# EAGLE schematic Board (EAGLE 6.4)
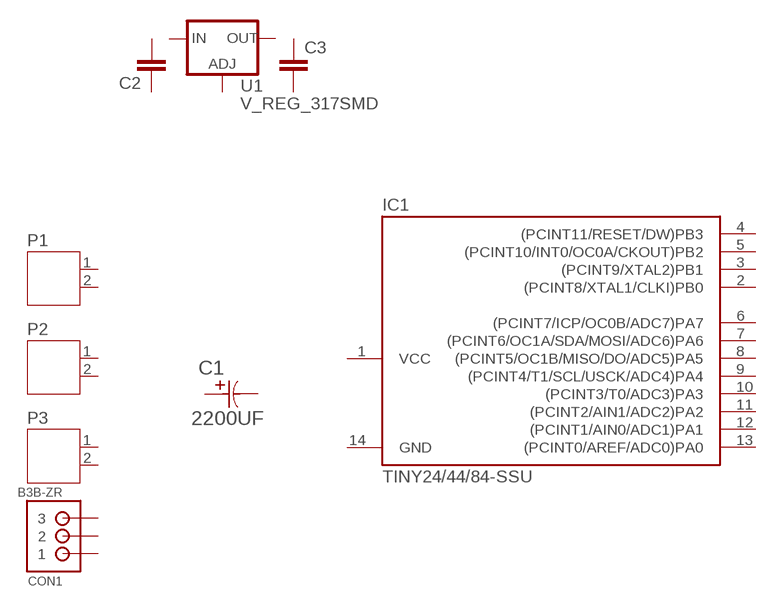
[diagram p0: schematic, sheet 1]

## Parts
C1  2200UF  EEV-FK1A222Q-CASE-H13  [CAPAE1350X1400N]
C2  CAP1210  [1210]
C3  CAP1210  [1210]
CON1  B3B-ZR  [B3B-ZR]
IC1  TINY24/44/84-SSU  [SOIC14]
P1  JST-PH2  [JST-PH2]
P2  JST-PH2  [JST-PH2]
P3  JST-PH2  [JST-PH2]
U1  V_REG_317SMD  [SOT223]
Unconnected: C1.1 C1.2 C2.1 C2.2 C3.1 C3.2 CON1.1 CON1.2 CON1.3 IC1.2((PCINT8/XTAL1/CLKI)PB0) IC1.3((PCINT9/XTAL2)PB1) IC1.4((PCINT11/RESET/DW)PB3) IC1.5((PCINT10/INT0/OC0A/CKOUT)PB2) IC1.6((PCINT7/ICP/OC0B/ADC7)PA7) IC1.7((PCINT6/OC1A/SDA/MOSI/ADC6)PA6) IC1.8((PCINT5/OC1B/MISO/DO/ADC5)PA5) IC1.9((PCINT4/T1/SCL/USCK/ADC4)PA4) IC1.10((PCINT3/T0/ADC3)PA3) IC1.11((PCINT2/AIN1/ADC2)PA2) IC1.12((PCINT1/AIN0/ADC1)PA1) IC1.13((PCINT0/AREF/ADC0)PA0) P1.1 P1.2 P2.1 P2.2 P3.1 P3.2 U1.1(ADJ) U1.2(OUT) U1.3(IN)

## Power pins joined to a net without a drawn wire
GND: IC1.14(GND)
VCC: IC1.1(VCC)

## Library data of the parts
C1 = Panasonic-EEEH_EEET_EEHZ_EEV:EEV-: Aluminum Electrolytic Capacitors,Surface Mount Type; MPN: EEV-FK1A222Q; OC_FARNELL: 2282090; OC_NEWARK: 53W3897; PACKAGE: CASE-H13; SUPPLIER: PANASONIC; TOLERANCE: ±20 %; VOLTAGERATING: 10V
C2 C3 = SparkFun:CAP: Capacitor Standard 0603 ceramic capacitor, and 0.1" leaded capacitor.
CON1 = jst:B3B-ZR: JST-ZH Connector 3 pol, 1.5mm pitch Package: B3B-ZR Source: http://www.jst-mfg.com/product/pdf/eng/eZH.pdf
IC1 = avr-7:TINY24/44/84
P1-P3 = jst-ph:JST-PH2
U1 = SparkFun:V_REG_317: Voltage Regulator Standard LM317 adjustable voltage regulator. AOI (Adjust Output Input). Google 'LM317 Calculator' for easy to use app to get the two resistor values needed. 240/720 for 5V output. 240/390 for 3.3V output. Spark Fun Electronics SKU : COM-00527